# Altium schematic sheet Sheet3.SchDoc
size A4; SheetNumber: 3; SheetTotal: 3
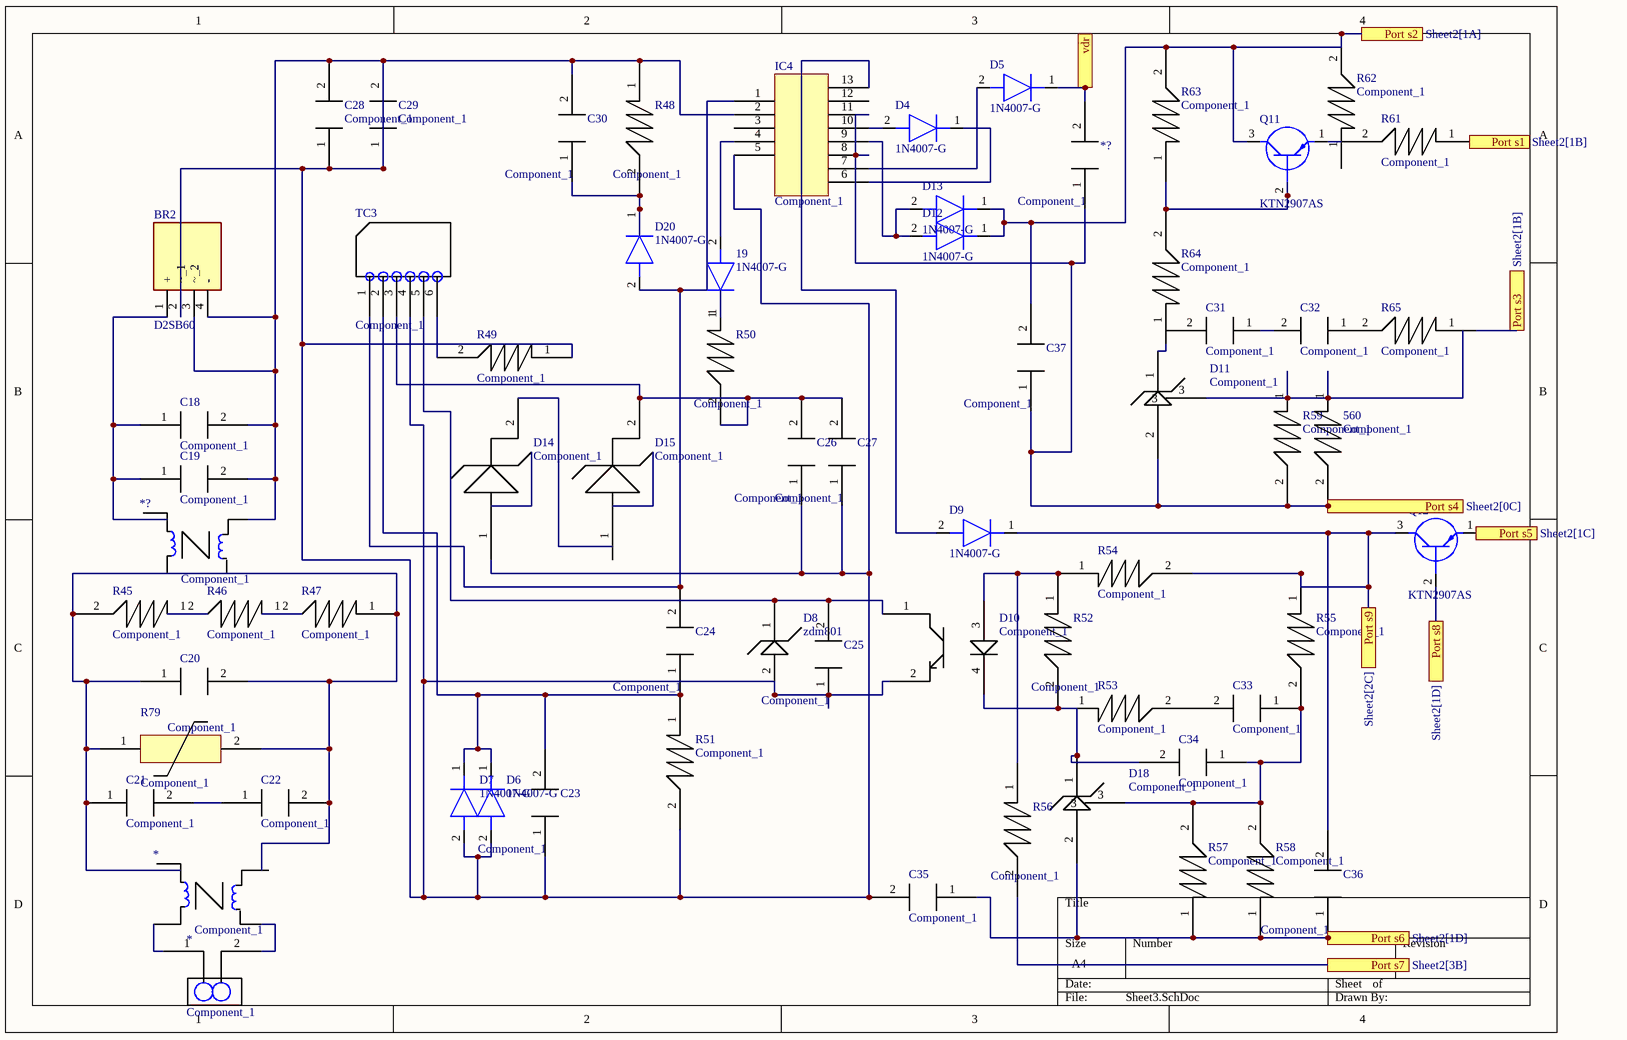
[diagram p0: Sheet3.SchDoc]

## Parts
(Parts that share a designator on the sheet are numbered #1, #2 ... from top to bottom, then left to right.)
19  1N4007-G  [DIOAD1410W90L470D235]
560  Component_1  [PCBComponent_1]
*#1  Component_1  [PCBComponent_1]
*#2  Component_1  [PCBComponent_1]
*?#1  Component_1  [PCBComponent_1]
*?#2  Component_1  [PCBComponent_1]
BR2  D2SB60  [D2SB60]
C18  Component_1  [PCBComponent_1]
C19  Component_1  [PCBComponent_1]
C20  Component_1  [PCBComponent_1]
C21  Component_1  [PCBComponent_1]
C22  Component_1  [PCBComponent_1]
C23  Component_1  [PCBComponent_1]
C24  Component_1  [PCBComponent_1]
C25  Component_1  [PCBComponent_1]
C26  Component_1  [PCBComponent_1]
C27  Component_1  [PCBComponent_1]
C28  Component_1  [PCBComponent_1]
C29  Component_1  [PCBComponent_1]
C30  Component_1  [PCBComponent_1]
C31  Component_1  [PCBComponent_1]
C32  Component_1  [PCBComponent_1]
C33  Component_1  [PCBComponent_1]
C34  Component_1  [PCBComponent_1]
C35  Component_1  [PCBComponent_1]
C36  Component_1  [PCBComponent_1]
C37  Component_1  [PCBComponent_1]
D4  1N4007-G  [DIOAD1410W90L470D235]
D5  1N4007-G  [DIOAD1410W90L470D235]
D6  1N4007-G  [DIOAD1410W90L470D235]
D7  1N4007-G  [DIOAD1410W90L470D235]
D8  zdm801  [PCBComponent_1]
D9  1N4007-G  [DIOAD1410W90L470D235]
D10  Component_1  [PCBComponent_1]
D11  Component_1  [PCBComponent_1]
D12  1N4007-G  [DIOAD1410W90L470D235]
D13  1N4007-G  [DIOAD1410W90L470D235]
D14  Component_1
D15  Component_1
D18  Component_1  [PCBComponent_1]
D20  1N4007-G  [DIOAD1410W90L470D235]
IC4  Component_1  [PCBComponent_1]
Q11  KTN2907AS  [SOT95P245X130-3N]
Q12  KTN2907AS  [SOT95P245X130-3N]
R45  Component_1  [PCBComponent_1]
R46  Component_1  [PCBComponent_1]
R47  Component_1  [PCBComponent_1]
R48  Component_1  [PCBComponent_1]
R49  Component_1  [PCBComponent_1]
R50  Component_1  [PCBComponent_1]
R51  Component_1  [PCBComponent_1]
R52  Component_1  [PCBComponent_1]
R53  Component_1  [PCBComponent_1]
R54  Component_1  [PCBComponent_1]
R55  Component_1  [PCBComponent_1]
R56  Component_1  [PCBComponent_1]
R57  Component_1  [PCBComponent_1]
R58  Component_1  [PCBComponent_1]
R59  Component_1  [PCBComponent_1]
R61  Component_1  [PCBComponent_1]
R62  Component_1  [PCBComponent_1]
R63  Component_1  [PCBComponent_1]
R64  Component_1  [PCBComponent_1]
R65  Component_1  [PCBComponent_1]
R79  Component_1
TC3  Component_1  [PCBComponent_1]

## Ports
Port s1 (see Sheet2[1B]), Port s2 (see Sheet2[1A]), Port s3 (see Sheet2[1B]), Port s4 (see Sheet2[0C]), Port s5 (see Sheet2[1C]), Port s6 (see Sheet2[1D]), Port s7 (see Sheet2[3B]), Port s8 (see Sheet2[1D]), Port s9 (see Sheet2[2C]), vdr

## Nets
Port s2: C37.2 D12.1(K) D13.1(K) Q11.3(C) R62.2 R63.2 ; port Port s2
Port s3: R65.1 ; port Port s3
Port s4: 560.2 *?#1.1 C37.1 D11.2 IC4.8 IC4.11 R59.2 ; port Port s4
Port s5: Q12.1(E) ; port Port s5
Port s6: C35.1 C36.1 D18.2 R57.1 R58.1 ; port Port s6
Port s7: R56.2 ; port Port s7
Port s8: Q12.2(B) ; port Port s8
Port s9: C36.2 D9.1(K) Q12.3(C) R54.2 R55.1 ; port Port s9
vdr: *?#1.2 D5.1(K) ; port vdr
Net19_1: 19.1(K) R50.1
Net19_2: 19.2(A) IC4.4
Net560_1: 560.1 D11.3 R59.1
NetBR2_1: BR2.1(+) C18.1 C19.1
NetBR2_2: BR2.2(~_1) BR2.3(~_2) BR2.4(-) C18.2 C19.2 C23.1 C25.1 C26.1 C27.1 C28.1 C28.2 C29.1 C29.2 C30.2 C35.2 D6.2(A) D7.2(A) D8.2 D10.2 D14.1 IC4.2 IC4.5 R48.1 R49.1 R51.2 TC3.4
NetC20_1: C20.1 C20.2 C21.1 C22.2 R45.2 R47.1 R79.1 R79.2
NetC21_2: C21.2 C22.1
NetC23_2: C23.2 C24.1 D6.1(K) D7.1(K) R51.1 TC3.2
NetC24_2: C24.2 D20.2(A) IC4.1 TC3.1
NetC25_2: C25.2 D8.1 D10.1 TC3.5
NetC26_2: C26.2 C27.2 D15.2 R50.2 TC3.3
NetC30_1: C30.1 D20.1(K) R48.2
NetC31_1: C31.1 C32.2
NetC33_1: C33.1 C34.1 D18.3 R55.2 R57.2 R58.2
NetC33_2: C33.2 R53.2
NetC34_2: C34.2 D10.4 D18.1 R52.2 R53.1
NetD4_1: D4.1(K) IC4.6
NetD4_2: D4.2(A) IC4.10
NetD5_2: D5.2(A) IC4.7
NetD9_2: D9.2(A) IC4.13
NetD10_3: D10.3 R52.1 R54.1 R56.1
NetD11_1: D11.1 R64.1
NetD12_2: D12.2(A) D13.2(A) IC4.9
NetQ11_1: Q11.1(E) R61.2
NetQ11_2: Q11.2(B) R63.1 R64.2
NetR45_1: R45.1 R46.2
NetR46_1: R46.1 R47.2
NetR49_2: R49.2 TC3.6

Not connected (* = marked no-connect by the designer): *#1 1 2; C31 2; C32 1; D14 2; D15 1; IC4 3 12; R61 1; R62 1; R65 2

## Library data of the parts
19 D4-D7 D9 D12 D13 D20 = 1N4007-G: Diode; Manufacturer_Name: Comchip Technology; Datasheet Link: https://datasheet.datasheetarchive.com/originals/distributors/Datasheets-DGA23/1390217.pdf; Manufacturer_Part_Number: 1N4007-G; Mouser Part Number: 750-1N4007-G; Mouser Price/Stock: https://www.mouser.co.uk/ProductDetail/Comchip-Technology/1N4007-G?qs=2qJf6qQ4IOKzApuByvlhjQ%3D%3D; Arrow Part Number: 1N4007-G; Arrow Price/Stock: https://www.arrow.com/en/products/1n4007-g/comchip-technology?region=nac
BR2 = D2SB60: Bridge Rectifier; Manufacturer_Name: Taiwan Semiconductor; Datasheet Link: https://www.taiwansemi.com/assets/uploads/datasheet/D2SB05%20SERIES_K2103.pdf; Height: 11.3mm; Manufacturer_Part_Number: D2SB60; Mouser Part Number: 821-D2SB60; Mouser Price/Stock: https://www.mouser.com/Search/Refine.aspx?Keyword=821-D2SB60
Q11 Q12 = KTN2907AS: Transistor BJT PNP; Manufacturer_Name: KEC; Datasheet Link: https://4donline.ihs.com/images/VipMasterIC/IC/KECC/KECC-S-A0011628695/KECC-S-A0011628695-1.pdf?hkey=EF798316E3902B6ED9A73243A3159BB0; Height: 1.3mm; Manufacturer_Part_Number: KTN2907AS